# Altium schematic sheet Teensy.SchDoc
size A; SheetNumber: 2; SheetTotal: 5
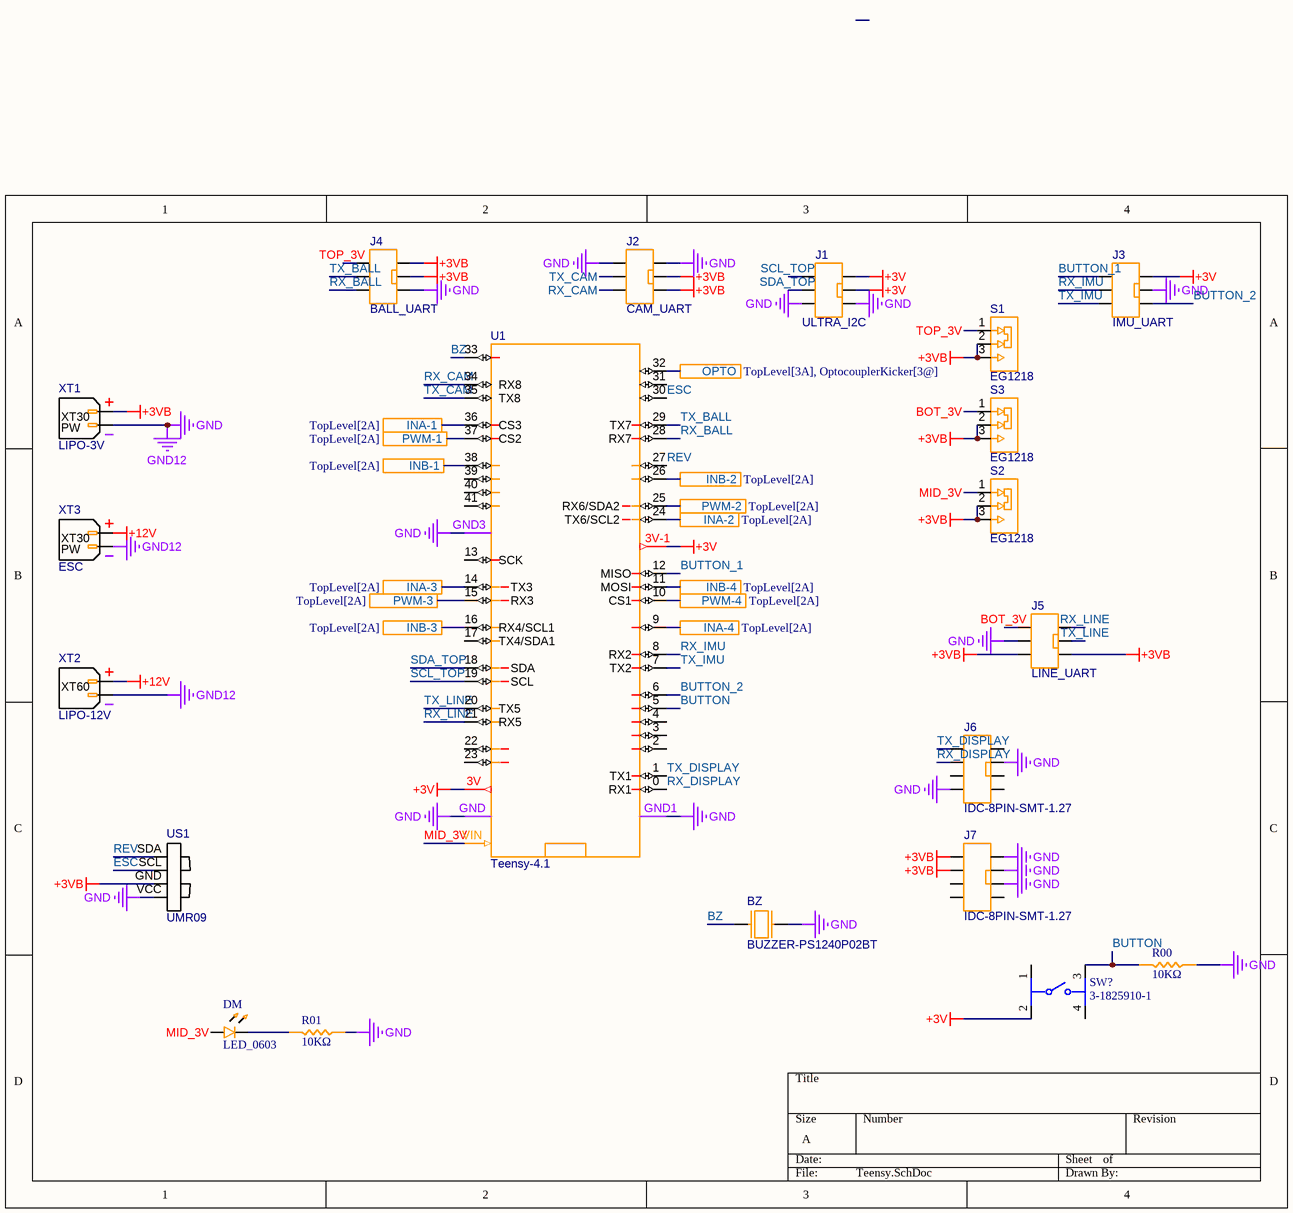
[diagram p0: Teensy.SchDoc]

## Parts
BZ  BUZZER-PS1240P02BT  [BUZZER-PS1240P02BT]
DM  LED_0603  [LED_0603]
J1  ULTRA_I2C  [IDC-6PIN-SMT-2.54]
J2  CAM_UART  [IDC-6PIN-SMT-2.54]
J3  IMU_UART  [IDC-6PIN-SMT-2.54]
J4  BALL_UART  [IDC-6PIN-SMT-2.54]
J5  LINE_UART  [IDC-6PIN-SMT-2.54]
J6  IDC-8PIN-SMT-1.27  [IDC-8PIN-SMT-1.27]
J7  IDC-8PIN-SMT-1.27  [IDC-8PIN-SMT-1.27]
R00  10KΩ  [RES_0603]
R01  10KΩ  [RES_0603]
S1  EG1218  [EG1218]
S2  EG1218  [EG1218]
S3  EG1218  [EG1218]
SW?  3-1825910-1  [FP-3-1825910-1-MFG]
U1  Teensy-4.1  [Teensy-4.1]
US1  UMR09  [URM09]
XT1  LIPO-3V  [XT30_PW_M]
XT2  LIPO-12V  [XT60-M]
XT3  ESC  [XT30_PW_M]

## Ports
INA-1 (see TopLevel[2A]), INA-2 (see TopLevel[2A]), INA-3 (see TopLevel[2A]), INA-4 (see TopLevel[2A]), INB-1 (see TopLevel[2A]), INB-2 (see TopLevel[2A]), INB-3 (see TopLevel[2A]), INB-4 (see TopLevel[2A]), OPTO (see TopLevel[3A], OptocouplerKicker[3@]), PWM-1 (see TopLevel[2A]), PWM-2 (see TopLevel[2A]), PWM-3 (see TopLevel[2A]), PWM-4 (see TopLevel[2A])

## Nets
+3V: J1.5 J1.6 J3.6 SW?.2 U1.3V U1.3V-1
+3VB: J2.4 J2.5 J4.5 J4.6 J5.3 J5.4 J7.1 J7.2 S1.2(COM) S1.3(NO) S2.2(COM) S2.3(NO) S3.2(COM) S3.3(NO) US1.GND XT1.P
+12V: XT2.P XT3.P
GND: BZ.2 J1.3 J1.4 J2.1 J2.6 J3.5 J4.4 J5.2 J6.4 J6.7 J7.6 J7.7 J7.8 R00.2 R01.2 U1.GND U1.GND1 U1.GND3 US1.VCC XT1.N XT2.N XT3.N  [also labelled GND12]
BOT_3V: J5.1 S3.1(NC)
BUTTON: R00.1 SW?.3 U1.5
BUTTON_1: J3.1 U1.12(MISO)
BUTTON_2: J3.4 U1.6
BZ: BZ.1 U1.33
ESC: U1.30 US1.SCL
INA-1: U1.36(CS3) ; port INA-1
INA-2: U1.24(TX6/SCL2) ; port INA-2
INA-3: U1.14(TX3) ; port INA-3
INA-4: U1.9 ; port INA-4
INB-1: U1.38 ; port INB-1
INB-2: U1.26 ; port INB-2
INB-3: U1.16(RX4/SCL1) ; port INB-3
INB-4: U1.11(MOSI) ; port INB-4
MID_3V: DM.A S2.1(NC) U1.VIN
OPTO: U1.32 ; port OPTO
PWM-1: U1.37(CS2) ; port PWM-1
PWM-2: U1.25(RX6/SDA2) ; port PWM-2
PWM-3: U1.15(RX3) ; port PWM-3
PWM-4: U1.10(CS1) ; port PWM-4
REV: U1.27 US1.SDA
RX_BALL: J4.3 U1.28(RX7)
RX_CAM: J2.3 U1.34(RX8)
RX_DISPLAY: J6.2 U1.0(RX1)
RX_IMU: J3.2 U1.8(RX2)
RX_LINE: J5.6 U1.21(RX5)
SCL_TOP: J1.1 U1.19(SCL)
SDA_TOP: J1.2 U1.18(SDA)
TOP_3V: J4.1 S1.1(NC)
TX_BALL: J4.2 U1.29(TX7)
TX_CAM: J2.2 U1.35(TX8)
TX_DISPLAY: J6.1 U1.1(TX1)
TX_IMU: J3.3 U1.7(TX2)
TX_LINE: J5.5 U1.20(TX5)
NetDM_C: DM.C R01.1

Not connected (* = marked no-connect by the designer): J6 3 5 6 8; J7 3 4 5; SW? 1 4; U1 2 3 4 13(SCK) 17(TX4/SDA1) 22 23 31 39 40 41

## Notes on the sheet
- (in symbol XT30_PW_M) XT30; PW
- (in symbol XT60-M) XT60

## Library data of the parts
J1-J5 = IDC-6PIN-SMT-2.54_1
R00 R01 = RES_0603: Resistor SMD 0603 generic
SW? = CMP-03407-000001-1: SWITCH TACTILE SPST-NO 0.05A 24V; Manufacturer: TE Connectivity; Operating Force: 160gf; Contact Current Rating: 50mA; Description: Switch Tactile OFF (ON) SPST Round Button PC Pins 0.05A 24VDC 100000Cycles 1.57N Thru-Hole; Contact Resistance: 100mΩ; Electromechanical Life: 100000Cycles; Device Class L1: Electromechanical; ComponentLink2URL: https://www.te.com/commerce/DocumentDelivery/DDEController?Action=srchrtrv&DocNm=1825910&DocType=Customer+Drawing&DocLang=English; Category: Switch; Device Class L2: Switches; Temperature: -35°C to +85°C; RoHS: TRUE; Mount: Through Hole; Manufacturer Part Number: 3-1825910-1; Automotive: No; Lead Free: Yes; Device Class L3: Tactile Switches; ComponentLink2Description: Datasheet; Temperature Range High: +85°C; Height: 17.3mm; Package: 0; Temperature Range Low: -35°C; Throw Configuration: SPST-NO; Digikey Description: SWITCH TACTILE SPST-NO 0.05A 24V; Octopart: https://octopart.com/3-1825910-1-te+connectivity-46506874
XT1 XT3 = XT30_PW_M
XT2 = XT60-M